# EAGLE design RJ45 - Muro (EAGLE 4.14)
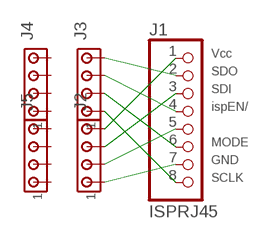
[diagram p0: schematic, sheet 1]

## Parts
J1  ISPRJ45  [RJ45-90]
J2  MTA04-100  [10X04MTA]
J3  MTA04-100  [10X04MTA]
J4  MTA04-100  [10X04MTA]
J5  MTA04-100  [10X04MTA]

## Nets
N$1: J1.2(SDO) J3.4
N$2: J1.4(ISPEN/) J3.3
N$3: J1.6(MODE) J3.2
N$4: J1.8(SCLK) J3.1
N$5: J1.1(VCC) J2.4
N$6: J1.3(SDI) J2.3
N$7: J1.5(N/C) J2.2
N$8: J1.7(GND) J2.1
Unconnected: J4.1 J4.2 J4.3 J4.4 J5.1 J5.2 J5.3 J5.4

## Library data of the parts
J1 = lattice:ISPRJ45: RJ-45 connector for in-circuit programming cable
J2-J5 = con-amp:MTA04-100: AMP connector

## Board
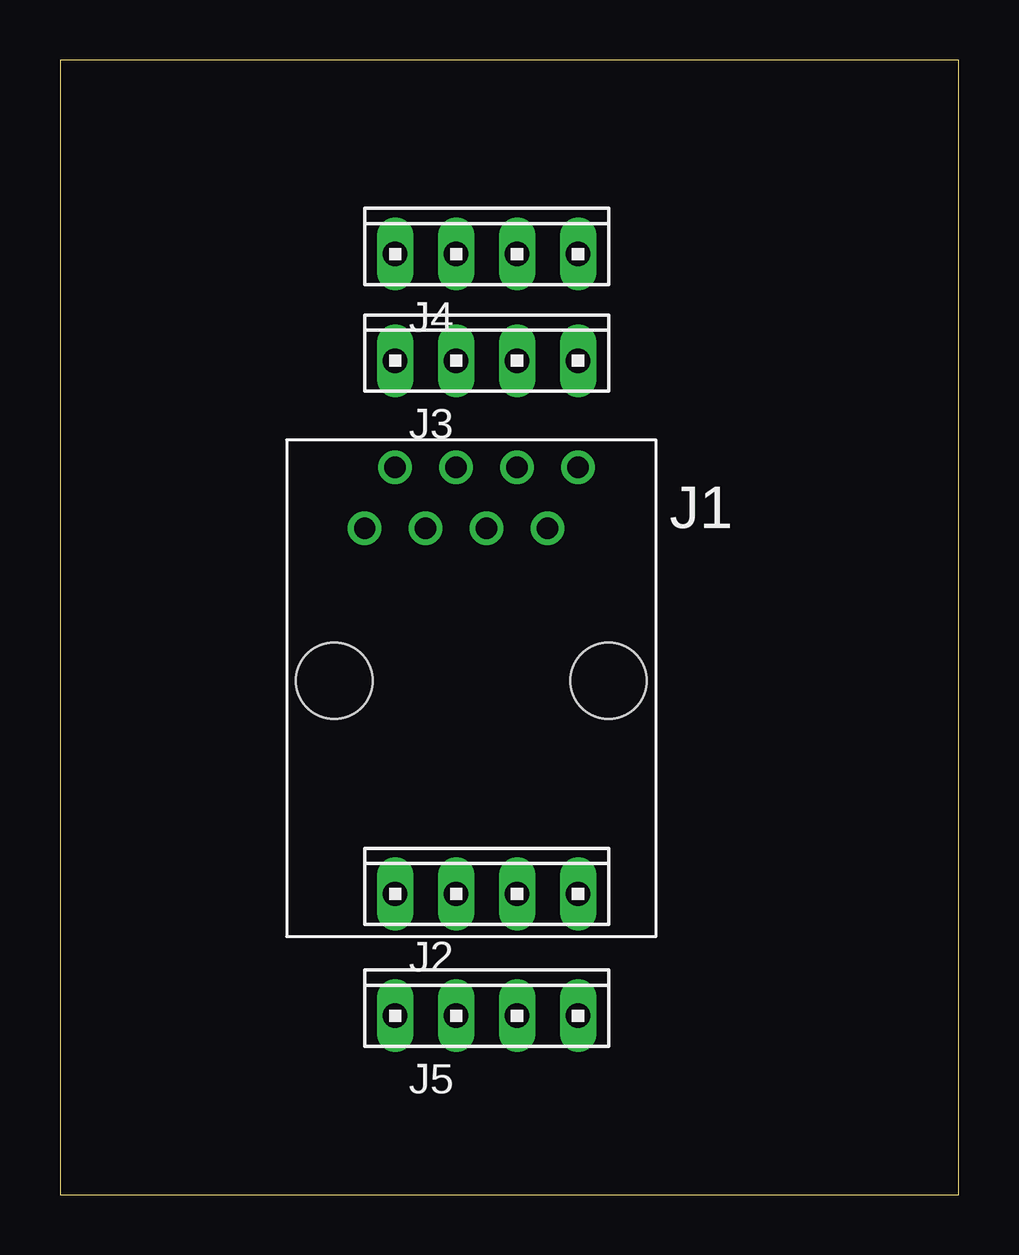
[diagram p1: board, top side]
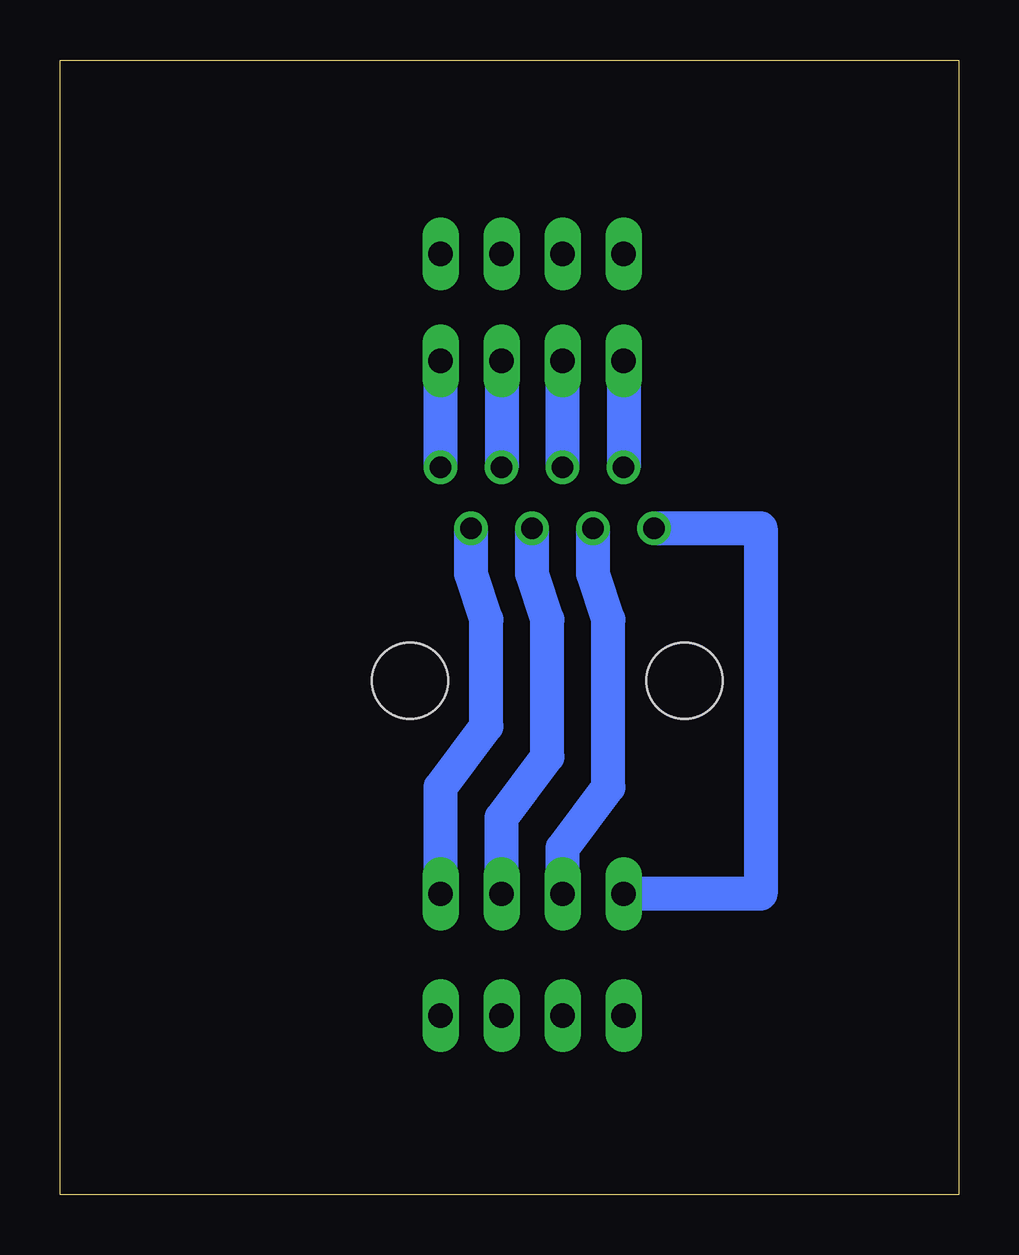
[diagram p2: board, bottom side, seen from below]

Size 37.45 x 47.3 mm. Coordinates in mm from the lower left corner, seen from the top.
Outline: 0,0 37.45,0 37.45,47.3 0,47.3 0,0
Copper layers (1*16): Top 0.035mm / dielectric 1.5mm / Bottom 0.035mm
Design rules "default": minimum track width 10mil, minimum drill 24mil, track to track 8mil, track to pad 8mil, pad to pad 8mil, via to via 8mil, smd to smd 8mil, copper to edge 40mil, drill to drill 8mil, minimum pad ring 10mil, minimum via ring 8mil, stop-mask expansion 4mil, vias tented up to drill 0mil, thermal gap 10mil

### Footprints (pad centres in the part's own frame; a part is rotated, then mirrored left to right if it is on the bottom)
RJ45-90 = drill 0.889 pad 1.397 round: 1 0,0; 2 1.27,2.54; 3 2.54,0; 4 3.81,2.54; 5 5.08,0; 6 6.35,2.54; 7 7.62,0; 8 8.89,2.54 | hole 3.175: 10.16,-6.35; -1.27,-6.35
10X04MTA = drill 1.016 long: 1 3.81,0; 2 1.27,0; 3 -1.27,0; 4 -3.81,0

### Placement (x,y rotation side)
J1  12.7,27.77 0 top
J2  17.77,12.54 0 top
J3  17.77,34.76 0 top
J4  17.77,39.2 0 top
J5  17.77,7.46 0 top

### Tracks (layer width: path | path; a pad name or v marks a point on that pad's centre or on a via)
N$1
  Bottom 1.422: J3.4 J1.2
N$2
  Bottom 1.422: J1.4 J3.3
N$3
  Bottom 1.422: J3.2 J1.6
N$4
  Bottom 1.422: J1.8 J3.1
N$5
  Bottom 1.422: J1.1 8.25,27.77 8.25,12.54 J2.4
N$6
  Bottom 1.422: J2.3 16.5,14.44 14.6,16.98 14.6,23.96 15.24,25.87 J1.3
N$7
  Bottom 1.422: J2.2 19.04,15.71 17.14,18.25 17.14,23.96 17.77,25.87 J1.5
N$8
  Bottom 1.422: J2.1 21.58,16.98 19.68,19.52 19.68,23.96 20.31,25.87 J1.7
N$9  (via drill 2)
  other vias: 11.43,21.42
N$10  (via drill 2)
  other vias: 22.86,21.42